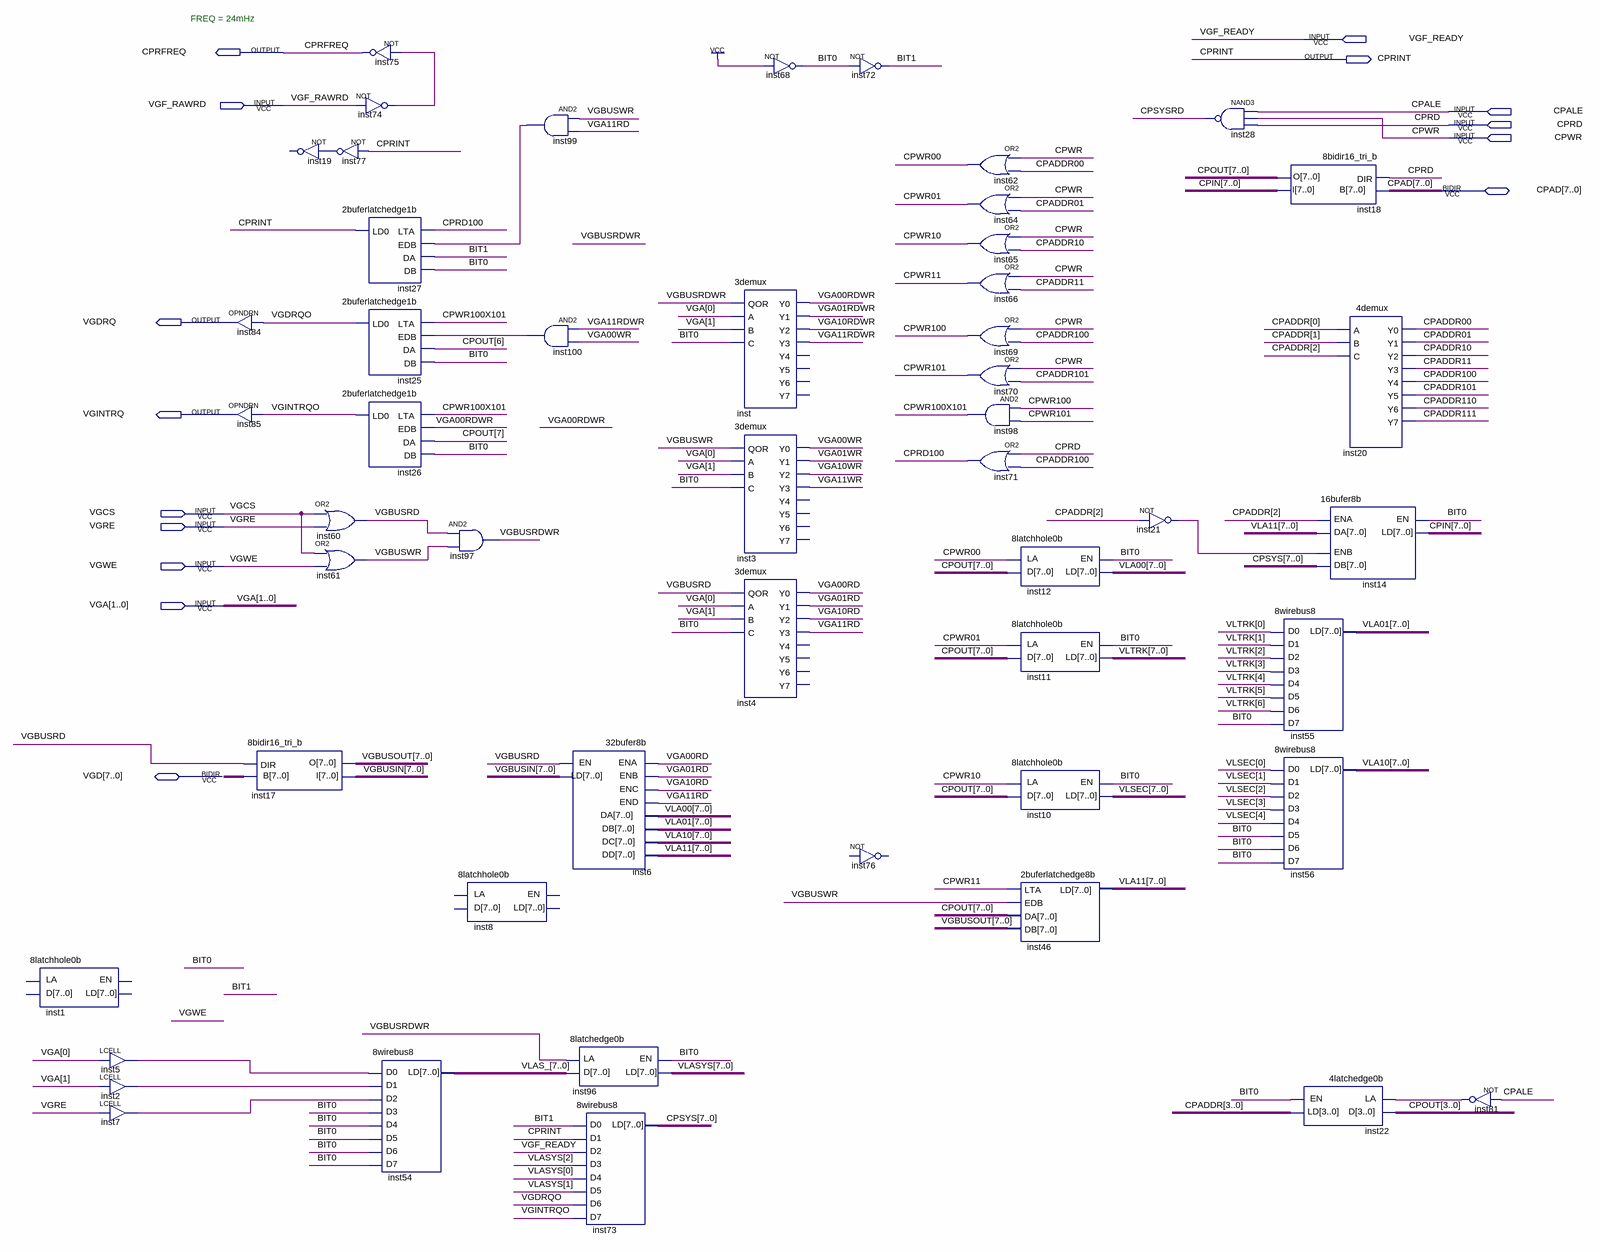
[diagram p0: schematic sheet]
// Quartus schematic WildFDDX.bdf as structural Verilog: 51 symbols, 15 pins
module WildFDDX (
  input  VGF_READY,
  input  VGF_RAWRD,
  input  CPALE,
  input  CPRD,
  input  CPWR,
  input  VGCS,
  input  VGRE,
  input  VGWE,
  input  [1:0] VGA,
  inout  [7:0] CPAD,
  inout  [7:0] VGD,
  output CPRFREQ,
  output CPRINT,
  output VGDRQ,
  output VGINTRQ
);

  wire BIT0, BIT1, CPADDR00, CPADDR01, CPADDR10, CPADDR11, CPADDR100, CPADDR101, CPADDR110, CPADDR111,
       CPRD100, CPSYSRD, CPWR00, CPWR01, CPWR10, CPWR11, CPWR100, CPWR100X101, CPWR101, inst2_out, inst5_out,
       inst7_out, inst21_out, inst74_out, inst77_out, inst81_out, inst99_out, inst100_out, VGA00RD,
       VGA00RDWR, VGA00WR, VGA01RD, VGA01RDWR, VGA01WR, VGA10RD, VGA10RDWR, VGA10WR, VGA11RD, VGA11RDWR,
       VGA11WR, VGBUSRD, VGBUSRDWR, VGBUSWR, VGDRQO, VGINTRQO;
  wire [3:0] CPADDR;
  wire [7:0] CPIN, CPOUT, CPSYS, VGBUSIN, VGBUSOUT, VLA00, VLA01, VLA10, VLA11, VLAS_, VLASYS, VLSEC, VLTRK;

  \8latchhole0b  inst1 ();  // open: EN, LA, D, LD
  LCELL inst5 (.IN(VGA[0]), .OUT(inst5_out));
  LCELL inst2 (.IN(VGA[1]), .OUT(inst2_out));
  LCELL inst7 (.IN(VGRE), .OUT(inst7_out));
  OPNDRN inst84 (.IN(VGDRQO), .OUT(VGDRQ));
  OPNDRN inst85 (.IN(VGINTRQO), .OUT(VGINTRQ));
  \8bidir16_tri_b  inst17 (.DIR(VGBUSRD), .I(VGBUSIN), .O(VGBUSOUT), .B(VGD));
  // NOT inst19 has open pins: IN=inst77_out, OUT=open
  not inst77 (inst77_out, CPRINT);
  or inst60 (VGBUSRD, VGCS, VGRE);
  or inst61 (VGBUSWR, VGCS, VGWE);
  not inst75 (CPRFREQ, inst74_out);
  not inst74 (inst74_out, VGF_RAWRD);
  \2buferlatchedge1b  inst27 (.LTA(CPRD100), .EDB(inst99_out), .DA(BIT1), .DB(BIT0), .LD0(CPRINT));
  \2buferlatchedge1b  inst25 (.LTA(CPWR100X101), .EDB(inst100_out), .DA(CPOUT[6]), .DB(BIT0), .LD0(VGDRQO));
  \2buferlatchedge1b  inst26 (.LTA(CPWR100X101), .EDB(VGA00RDWR), .DA(CPOUT[7]), .DB(BIT0), .LD0(VGINTRQO));
  \8wirebus8  inst54 (
    .D0(inst5_out), .D1(inst2_out), .D2(inst7_out), .D3(BIT0), .D4(BIT0), .D5(BIT0), .D6(BIT0), .D7(BIT0),
    .LD(VLAS_));
  and inst97 (VGBUSRDWR, VGBUSRD, VGBUSWR);
  \8latchhole0b  inst8 ();  // open: EN, LA, D, LD
  and inst99 (inst99_out, VGBUSWR, VGA11RD);
  and inst100 (inst100_out, VGA11RDWR, VGA00WR);
  \32bufer8b  inst6 (
    .EN(VGBUSRD), .ENA(VGA00RD), .ENB(VGA01RD), .ENC(VGA10RD), .END(VGA11RD), .DA(VLA00), .DB(VLA01),
    .DC(VLA10), .DD(VLA11), .LD(VGBUSIN));
  \8latchedge0b  inst96 (.EN(BIT0), .LA(VGBUSRDWR), .D(VLAS_), .LD(VLASYS));
  \8wirebus8  inst73 (
    .D0(BIT1), .D1(CPRINT), .D2(VGF_READY), .D3(VLASYS[2]), .D4(VLASYS[0]), .D5(VLASYS[1]), .D6(VGDRQO),
    .D7(VGINTRQO), .LD(CPSYS));
  \3demux  inst (
    .QOR(VGBUSRDWR), .A(VGA[0]), .B(VGA[1]), .C(BIT0), .Y0(VGA00RDWR), .Y1(VGA01RDWR), .Y2(VGA10RDWR),
    .Y3(VGA11RDWR));  // open: Y4, Y5, Y6, Y7
  \3demux  inst3 (
    .QOR(VGBUSWR), .A(VGA[0]), .B(VGA[1]), .C(BIT0), .Y0(VGA00WR), .Y1(VGA01WR), .Y2(VGA10WR), .Y3(VGA11WR));  // open: Y4, Y5, Y6, Y7
  \3demux  inst4 (
    .QOR(VGBUSRD), .A(VGA[0]), .B(VGA[1]), .C(BIT0), .Y0(VGA00RD), .Y1(VGA01RD), .Y2(VGA10RD), .Y3(VGA11RD));  // open: Y4, Y5, Y6, Y7
  not inst68 (BIT0, 1'b1);
  not inst72 (BIT1, BIT0);
  // NOT inst76 is placed but not wired
  or inst62 (CPWR00, CPWR, CPADDR00);
  or inst64 (CPWR01, CPWR, CPADDR01);
  or inst65 (CPWR10, CPWR, CPADDR10);
  or inst66 (CPWR11, CPWR, CPADDR11);
  or inst69 (CPWR100, CPWR, CPADDR100);
  or inst70 (CPWR101, CPWR, CPADDR101);
  and inst98 (CPWR100X101, CPWR100, CPWR101);
  or inst71 (CPRD100, CPRD, CPADDR100);
  \8latchhole0b  inst12 (.EN(BIT0), .LA(CPWR00), .D(CPOUT), .LD(VLA00));
  \8latchhole0b  inst11 (.EN(BIT0), .LA(CPWR01), .D(CPOUT), .LD(VLTRK));
  \8latchhole0b  inst10 (.EN(BIT0), .LA(CPWR10), .D(CPOUT), .LD(VLSEC));
  \2buferlatchedge8b  inst46 (.LTA(CPWR11), .EDB(VGBUSWR), .DA(CPOUT), .DB(VGBUSOUT), .LD(VLA11));
  not inst21 (inst21_out, CPADDR[2]);
  nand inst28 (CPSYSRD, CPALE, CPWR, CPRD);
  \8bidir16_tri_b  inst18 (.DIR(CPRD), .I(CPIN), .O(CPOUT), .B(CPAD));
  \8wirebus8  inst55 (
    .D0(VLTRK[0]), .D1(VLTRK[1]), .D2(VLTRK[2]), .D3(VLTRK[3]), .D4(VLTRK[4]), .D5(VLTRK[5]), .D6(VLTRK[6]),
    .D7(BIT0), .LD(VLA01));
  \8wirebus8  inst56 (
    .D0(VLSEC[0]), .D1(VLSEC[1]), .D2(VLSEC[2]), .D3(VLSEC[3]), .D4(VLSEC[4]), .D5(BIT0), .D6(BIT0),
    .D7(BIT0), .LD(VLA10));
  \16bufer8b  inst14 (.EN(BIT0), .ENA(CPADDR[2]), .ENB(inst21_out), .DA(VLA11), .DB(CPSYS), .LD(CPIN));
  \4latchedge0b  inst22 (.EN(BIT0), .LA(inst81_out), .D(CPOUT[3:0]), .LD(CPADDR));
  \4demux  inst20 (
    .A(CPADDR[0]), .B(CPADDR[1]), .C(CPADDR[2]), .Y0(CPADDR00), .Y1(CPADDR01), .Y2(CPADDR10), .Y3(CPADDR11),
    .Y4(CPADDR100), .Y5(CPADDR101), .Y6(CPADDR110), .Y7(CPADDR111));
  not inst81 (inst81_out, CPALE);

  // Notes on the sheet:
  //   FREQ = 24mHz
endmodule
